# EasyEDA schematic SCH_Servo_MOSFET_Circuit_2021-11-03.json

## Sheets
1 Servo_Test_Schematic_BJTs: TITLE: Sheet_2; REV: 1.0; Date: 2021-10-25; Sheet: 1/1; Drawn By: Tyler Kojak; Company: Your Company
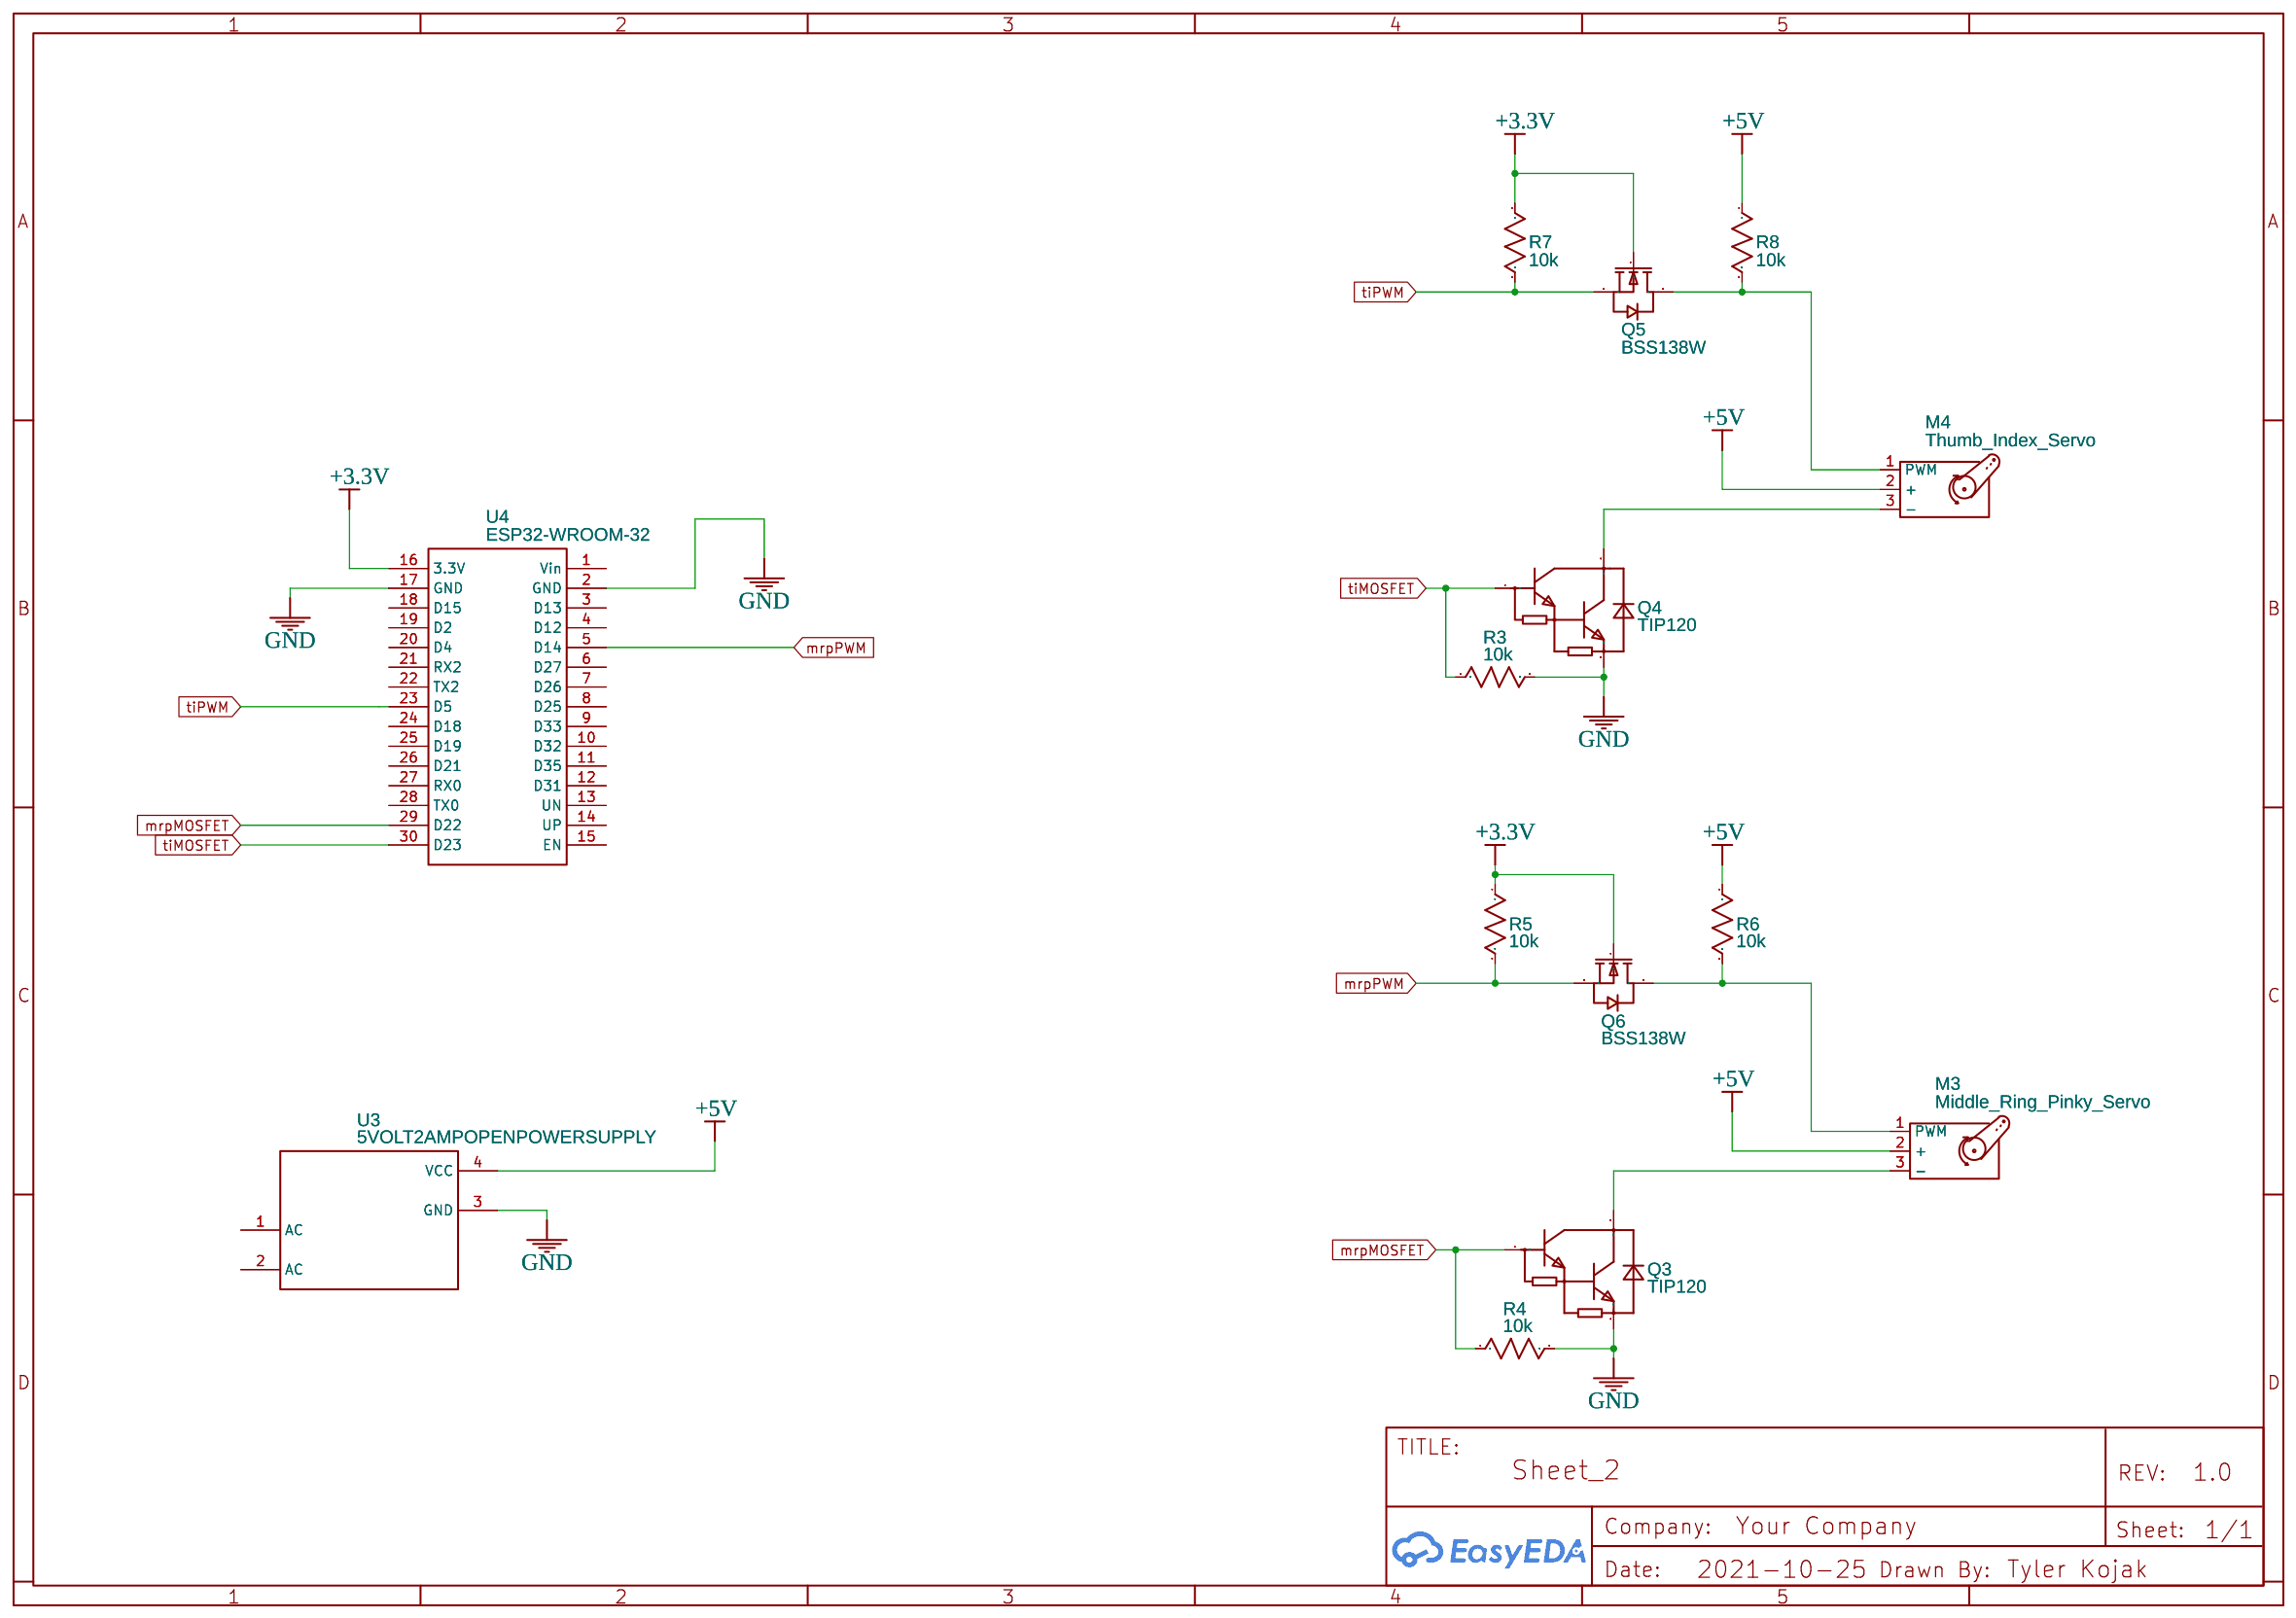
[diagram p0: Servo_Test_Schematic_BJTs]
2 Servo_Test_Schematic_MOSFETs: TITLE: Servo_Test_Schematic_Final; Date: 2021-10-28; Drawn By: morsjosh
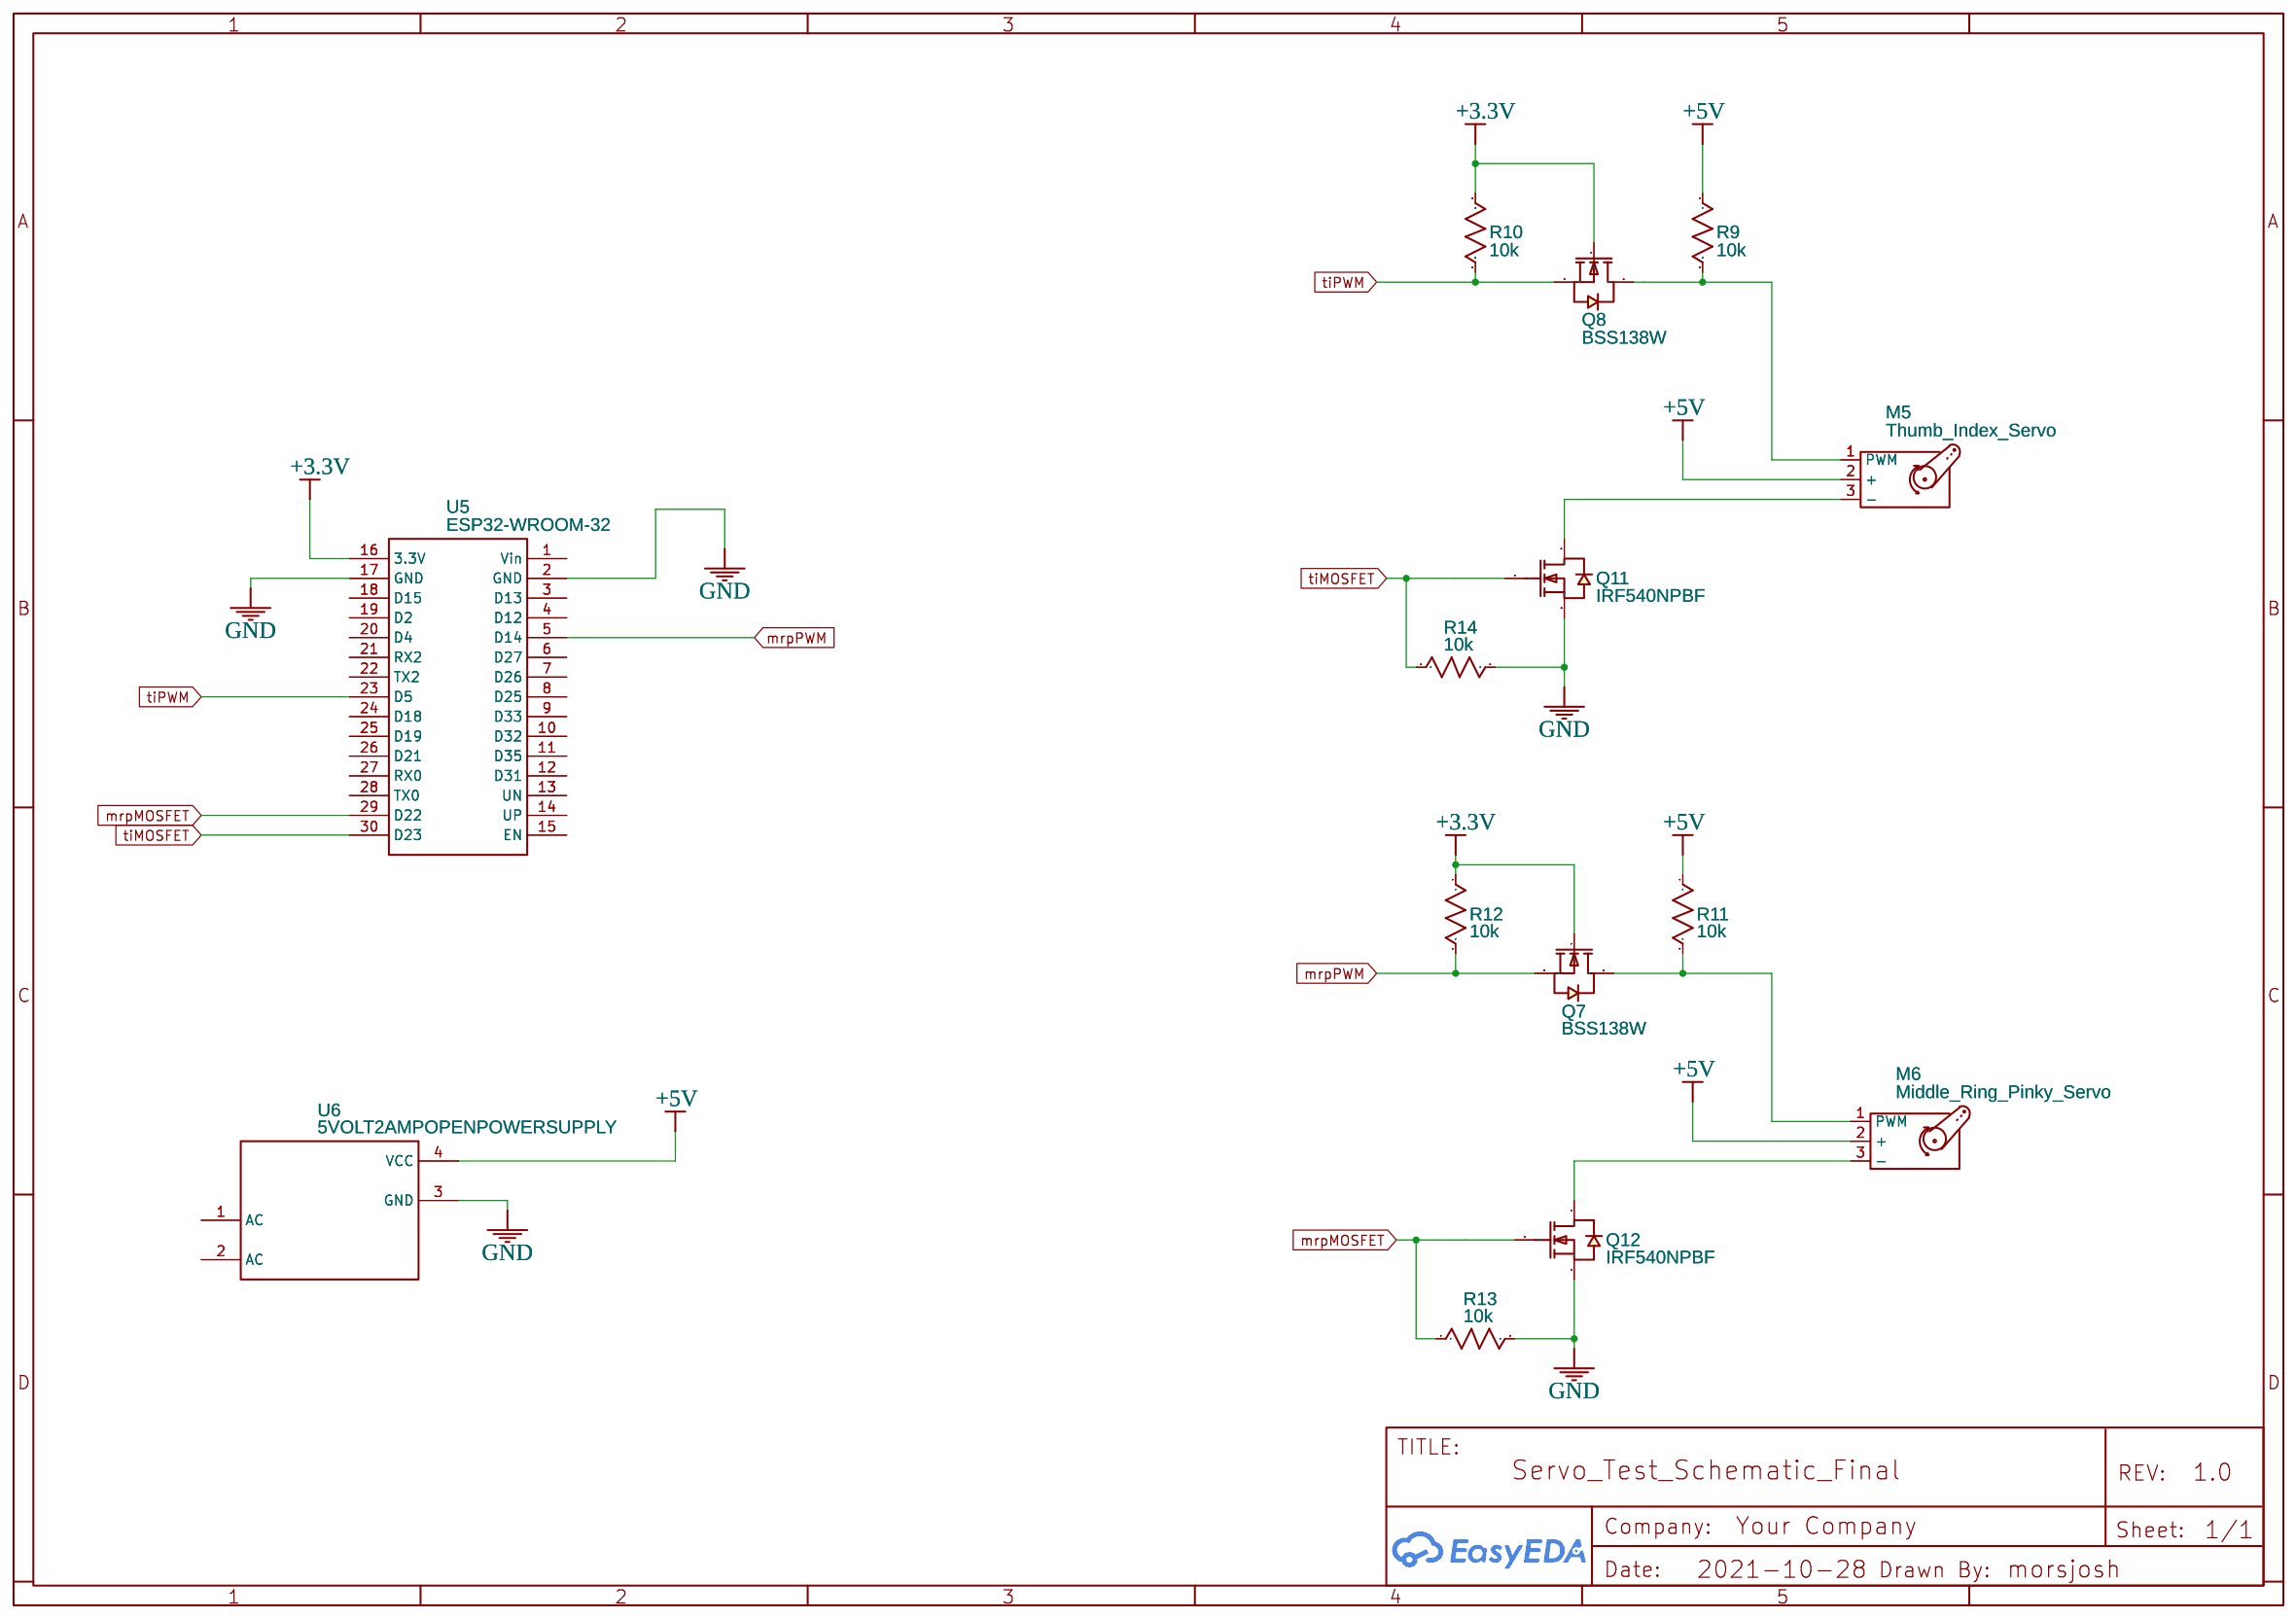
[diagram p1: Servo_Test_Schematic_MOSFETs]

## Parts
sheet Servo_Test_Schematic_BJTs
M3  Middle_Ring_Pinky_Servo
M4  Thumb_Index_Servo
Q3  TIP120  [TO-220-3_L10.0-W4.5-P2.54-L]
Q4  TIP120  [TO-220-3_L10.0-W4.5-P2.54-L]
Q5  BSS138W  [SOT-323-3_L2.0-W1.3-P1.30-LS2.1-BR]
Q6  BSS138W  [SOT-323-3_L2.0-W1.3-P1.30-LS2.1-BR]
R3  10k  [R0603]
R4  10k  [R0603]
R5  10k  [R0603]
R6  10k  [R0603]
R7  10k  [R0603]
R8  10k  [R0603]
U3  5VOLT2AMPOPENPOWERSUPPLY  [5VOLT2AMOOPENPOWERSUPPLY]
U4  ESP32-WROOM-32  [ESP32-WROOM-32]
sheet Servo_Test_Schematic_MOSFETs
M5  Thumb_Index_Servo
M6  Middle_Ring_Pinky_Servo
Q7  BSS138W  [SOT-323-3_L2.0-W1.3-P1.30-LS2.1-BR]
Q8  BSS138W  [SOT-323-3_L2.0-W1.3-P1.30-LS2.1-BR]
Q11  IRF540NPBF  [TO-220-3_L10.0-W4.5-P2.54-L]
Q12  IRF540NPBF  [TO-220-3_L10.0-W4.5-P2.54-L]
R9  10k  [R0603]
R10  10k  [R0603]
R11  10k  [R0603]
R12  10k  [R0603]
R13  10k  [R0603]
R14  10k  [R0603]
U5  ESP32-WROOM-32  [ESP32-WROOM-32]
U6  5VOLT2AMPOPENPOWERSUPPLY  [5VOLT2AMOOPENPOWERSUPPLY]

## Library data of the parts
M3-M6 = Motor_Servo: Contributor: KiCAD; license: https://www.gnu.org/licenses/lgpl-2.1.html
Q3 Q4 = TIP120: Supplier: LCSC; Supplier Part: C262990; Manufacturer: STMicroelectronics; Contributor: LCSC; JLCPCB Part Class: Extended Part
Q5-Q8 = BSS138W: Supplier: LCSC; Supplier Part: C504052; Manufacturer: CJ; Contributor: LCSC; JLCPCB Part Class: Extended Part
R3-R14 = R_0603_US: Contributor: LCEDA_Lib
U3 U6 = 5VOLT2AMPOPENPOWERSUPPLY: Contributor: himanshusingh0046
U4 U5 = ESP32-WROOM-32: Manufacturer: Espressif; Supplier: Espressif; link: https://www.espressif.com/sites/default/files/documentation/esp32_datasheet_en.pdf; Contributor: neil060802
Q11 Q12 = IRF540NPBF: Supplier: LCSC; Manufacturer: Infineon; Supplier Part: C2566; JLCPCB Part Class: Extended Part

## Nets
+3.3V: Q5.1(G) Q6.1(G) Q7.1(G) Q8.1(G) R5.1 R7.1 R10.1 R12.1 U4.16(3.3V) U5.16(3.3V)
+5V: M3.2(+) M4.2(+) M5.2(+) M6.2(+) R6.1 R8.1 R9.1 R11.1 U3.4(VCC) U6.4(VCC)
GND: Q3.3(E) Q4.3(E) Q11.3(S) Q12.3(S) R3.2 R4.2 R13.2 R14.2 U3.3(GND) U4.2(GND) U4.17(GND) U5.2(GND) U5.17(GND) U6.3(GND)
mrpMOSFET: Q3.1(B) Q12.1(G) R4.1 R13.1 U4.29(D22) U5.29(D22)
mrpPWM: Q6.2(S) Q7.2(S) R5.2 R12.2 U4.5(D14) U5.5(D14)
tiMOSFET: Q4.1(B) Q11.1(G) R3.1 R14.1 U4.30(D23) U5.30(D23)
tiPWM: Q5.2(S) Q8.2(S) R7.2 R10.2 U4.23(D5) U5.23(D5)
Net-(M3-1): M3.1(PWM) Q6.3(D) R6.2
Net-(M3-3): M3.3(-) Q3.2(C)
Net-(M4-1): M4.1(PWM) Q5.3(D) R8.2
Net-(M4-3): M4.3(-) Q4.2(C)
Net-(M5-1): M5.1(PWM) Q8.3(D) R9.2
Net-(M5-3): M5.3(-) Q11.2(D)
Net-(M6-1): M6.1(PWM) Q7.3(D) R11.2
Net-(M6-3): M6.3(-) Q12.2(D)

Not connected (* = marked no-connect by the designer): U3 1(AC) 2(AC); U4 1(Vin) 3(D13) 4(D12) 6(D27) 7(D26) 8(D25) 9(D33) 10(D32) 11(D35) 12(D31) 13(UN) 14(UP) 15(EN) 18(D15) 19(D2) 20(D4) 21(RX2) 22(TX2) 24(D18) 25(D19) 26(D21) 27(RX0) 28(TX0); U5 1(Vin) 3(D13) 4(D12) 6(D27) 7(D26) 8(D25) 9(D33) 10(D32) 11(D35) 12(D31) 13(UN) 14(UP) 15(EN) 18(D15) 19(D2) 20(D4) 21(RX2) 22(TX2) 24(D18) 25(D19) 26(D21) 27(RX0) 28(TX0); U6 1(AC) 2(AC)
